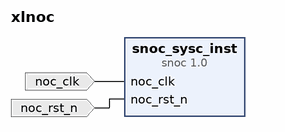
[diagram p0: block diagram of the top level]
# Vivado block design xlnoc, xcve2802-vsvh1760-2MP-e-S, Vivado 2024.2
create_bd_design xlnoc

create_bd_port -dir I -type clk noc_clk
create_bd_port -dir I -type rst noc_rst_n

create_bd_cell -type ip -vlnv xilinx.com:ip:snoc:1.0 snoc_sysc_inst

# ---- connections ----

connect_bd_net [get_bd_ports noc_clk] [get_bd_pins snoc_sysc_inst/noc_clk]
connect_bd_net [get_bd_ports noc_rst_n] [get_bd_pins snoc_sysc_inst/noc_rst_n]

validate_bd_design
save_bd_design
